# Altium schematic sheet TESTER_REMOTE_CONTROLLER_02.SchDoc: TESTER_REMOTE_CONTROLLER
size A4; CheckedBy: A.MOALLEMI; DrawnBy: A.RAJABI; SheetNumber: 1; SheetTotal: 3
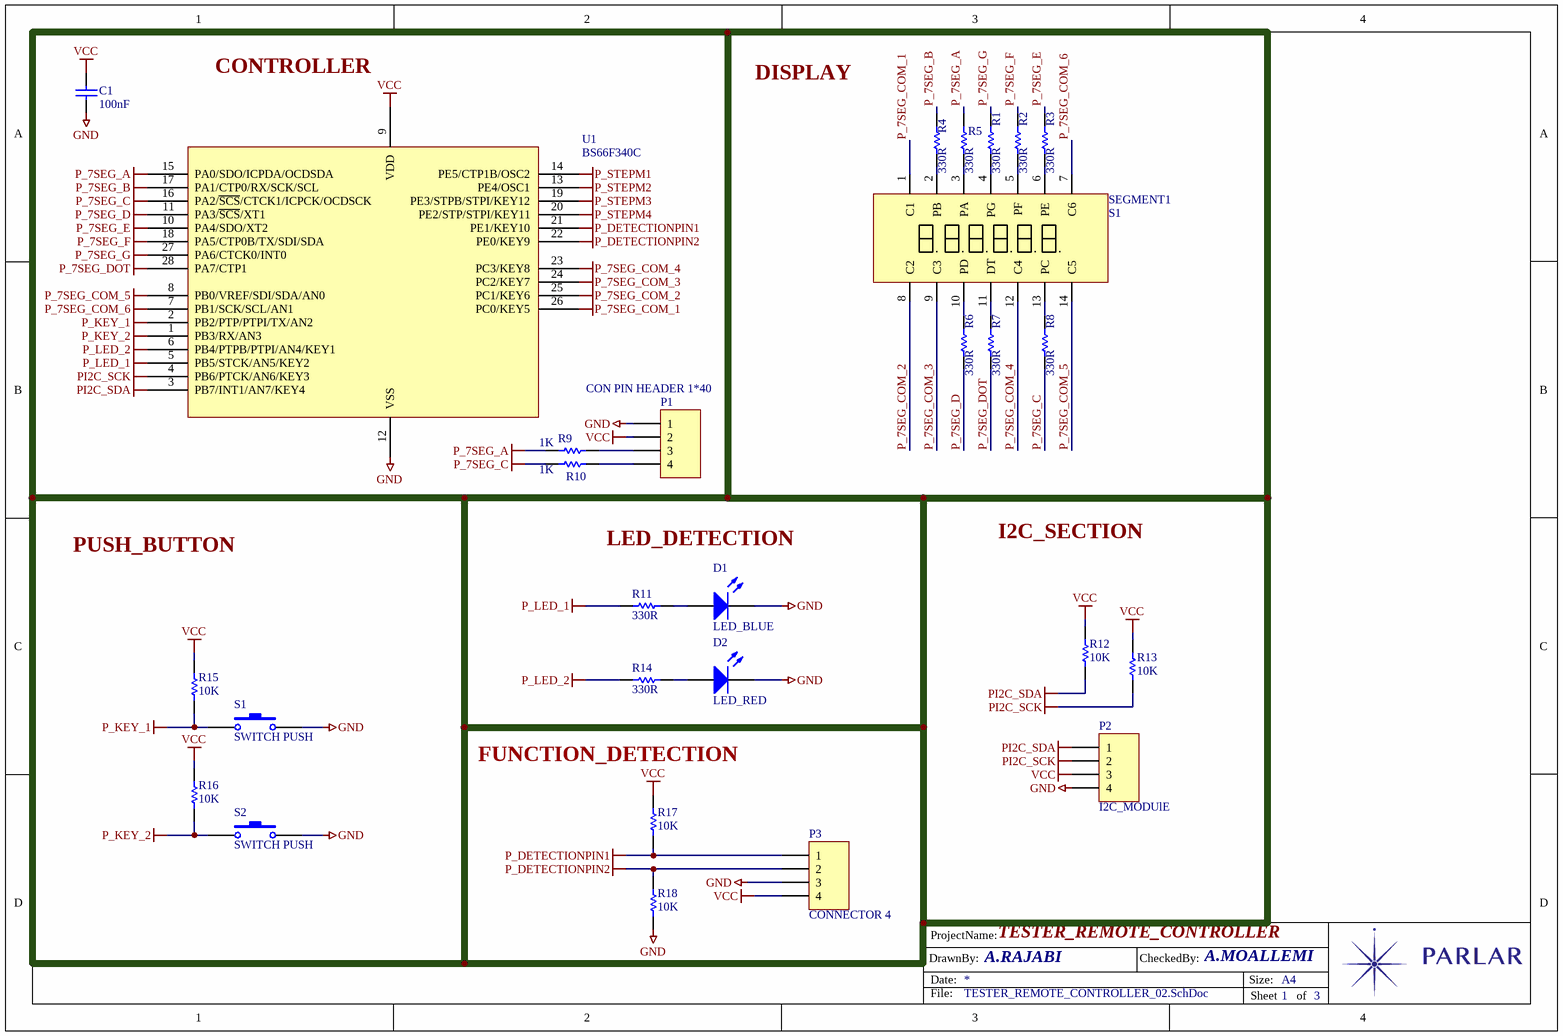
[diagram p0: TESTER_REMOTE_CONTROLLER_02.SchDoc]

## Parts
C1  100nF  [SMD 0805]
D1  LED_BLUE  [LED 5MM]
D2  LED_RED  [LED 5MM]
P1  CON PIN HEADER 1*40  [CON HDR 2.54FM 4]
P2  I2C_MODUlE  [CON HDR 2.54FM 4]
P3  CONNECTOR 4  [CON XH 4]
R1  330R  [SMD 1206]
R2  330R  [SMD 1206]
R3  330R  [SMD 1206]
R4  330R  [SMD 1206]
R5  330R  [SMD 1206]
R6  330R  [SMD 1206]
R7  330R  [SMD 1206]
R8  330R  [SMD 1206]
R9  1K  [SMD 0805]
R10  1K  [SMD 0805]
R11  330R  [SMD 0805]
R12  10K  [SMD 1206]
R13  10K  [SMD 0805]
R14  330R  [SMD 0805]
R15  10K  [SMD 0805]
R16  10K  [SMD 0805]
R17  10K  [SMD 0805]
R18  10K  [SMD 0805]
S1  SWITCH PUSH  [SW 6X6]
S2  SWITCH PUSH  [SW 6X6]
SEGMENT1  S1  [7SEG_6DIGIT]
U1  BS66F340C  [SMD IC SSOP28-HOLTEK]

## Nets
GND: C1.2 D1.2 D2.2 P1.1 P2.4 P3.3 R18.2 S1.2 S2.2 U1.12(VSS)
P_7SEG_A: R5.2 R9.1 U1.15(PA0/SDO/ICPDA/OCDSDA)
P_7SEG_B: R4.2 U1.17(PA1/CTP0/RX/SCK/SCL)
P_7SEG_C: R8.1 R10.1 U1.16(PA2/~{SCS}/CTCK1/ICPCK/OCDSCK)
P_7SEG_COM_1: SEGMENT1.1(C1) U1.26(PC0/KEY5)
P_7SEG_COM_2: SEGMENT1.8(C2) U1.25(PC1/KEY6)
P_7SEG_COM_3: SEGMENT1.9(C3) U1.24(PC2/KEY7)
P_7SEG_COM_4: SEGMENT1.12(C4) U1.23(PC3/KEY8)
P_7SEG_COM_5: SEGMENT1.14(C5) U1.8(PB0/VREF/SDI/SDA/AN0)
P_7SEG_COM_6: SEGMENT1.7(C6) U1.7(PB1/SCK/SCL/AN1)
P_7SEG_D: R6.1 U1.11(PA3/~{SCS}/XT1)
P_7SEG_DOT: R7.1 U1.28(PA7/CTP1)
P_7SEG_E: R3.1 U1.10(PA4/SDO/XT2)
P_7SEG_F: R2.2 U1.18(PA5/CTP0B/TX/SDI/SDA)
P_7SEG_G: R1.1 U1.27(PA6/CTCK0/INT0)
P_DETECTIONPIN1: P3.1 R17.2 U1.21(PE1/KEY10)
P_DETECTIONPIN2: P3.2 R18.1 U1.22(PE0/KEY9)
P_KEY_1: R15.1 S1.1 U1.2(PB2/PTP/PTPI/TX/AN2)
P_KEY_2: R16.1 S2.1 U1.1(PB3/RX/AN3)
P_LED_1: R11.1 U1.5(PB5/STCK/AN5/KEY2)
P_LED_2: R14.1 U1.6(PB4/PTPB/PTPI/AN4/KEY1)
P_STEPM1: U1.14(PE5/CTP1B/OSC2)
P_STEPM2: U1.13(PE4/OSC1)
P_STEPM3: U1.19(PE3/STPB/STPI/KEY12)
P_STEPM4: U1.20(PE2/STP/STPI/KEY11)
PI2C_SCK: P2.2 R13.1 U1.4(PB6/PTCK/AN6/KEY3)
PI2C_SDA: P2.1 R12.1 U1.3(PB7/INT1/AN7/KEY4)
VCC: C1.1 P1.2 P2.3 P3.4 R12.2 R13.2 R15.2 R16.2 R17.1 U1.9(VDD)
NetD1_1: D1.1 R11.2
NetD2_1: D2.1 R14.2
NetP1_3: P1.3 R9.2
NetP1_4: P1.4 R10.2
NetR1_2: R1.2 SEGMENT1.4(PG)
NetR2_1: R2.1 SEGMENT1.5(PF)
NetR3_2: R3.2 SEGMENT1.6(PE)
NetR4_1: R4.1 SEGMENT1.2(PB)
NetR5_1: R5.1 SEGMENT1.3(PA)
NetR6_2: R6.2 SEGMENT1.10(PD)
NetR7_2: R7.2 SEGMENT1.11(DT)
NetR8_2: R8.2 SEGMENT1.13(PC)

## Notes on the sheet
- FUNCTION_DETECTION
- Labels drawn without touching a wire or pin: CONTROLLER, DISPLAY, I2C_SECTION, LED_DETECTION, PUSH_BUTTON
- DrawnBy:
- ProjectName:
- Date:
- CheckedBy:
- Size:
- A4
- File:
- Sheet
- of

## Library data of the parts
C1 = CAP: Capacitor; Published: 8-Jun-2000; LatestRevisionDate: 17-Jul-2002; LatestRevisionNote: Re-released for DXP Platform.; PackageReference: RAD-0.3; Publisher: Altium Limited; PackageDescription: Radial Cap, Thru-Hole; 2 Leads; 0.3 in Pin Spacing
D1 D2 = LED: Typical INFRARED GaAs LED; Published: 8-Jun-2000; LatestRevisionDate: 08-Jul-2005; LatestRevisionNote: Mech Layer 1 removed.; PackageReference: LED-0; Publisher: Altium Limited; PackageDescription: LED; 2 Leads
P1-P3 = CONNECTOR 4: Header, 4-Pin; LatestRevisionDate: 17-Jul-2002; LatestRevisionNote: Re-released for DXP Platform.; Publisher: Altium Limited
R1-R18 = RES: Resistor
S1 S2 = SWITCH PUSH: Switch; Published: 24-Mar-1999; LatestRevisionDate: 17-Jul-2002; LatestRevisionNote: Re-released for DXP Platform.; PackageReference: SPST-2; Publisher: Altium Limited; PackageDescription: Switch; 2 Leads
SEGMENT1 = 7SEG_6DIGIT
U1 = IC BS66F340C: Enhanced Touch A/D Flash MCU, 28-Pin